# EAGLE design TapClip.v2 (EAGLE 6.2)
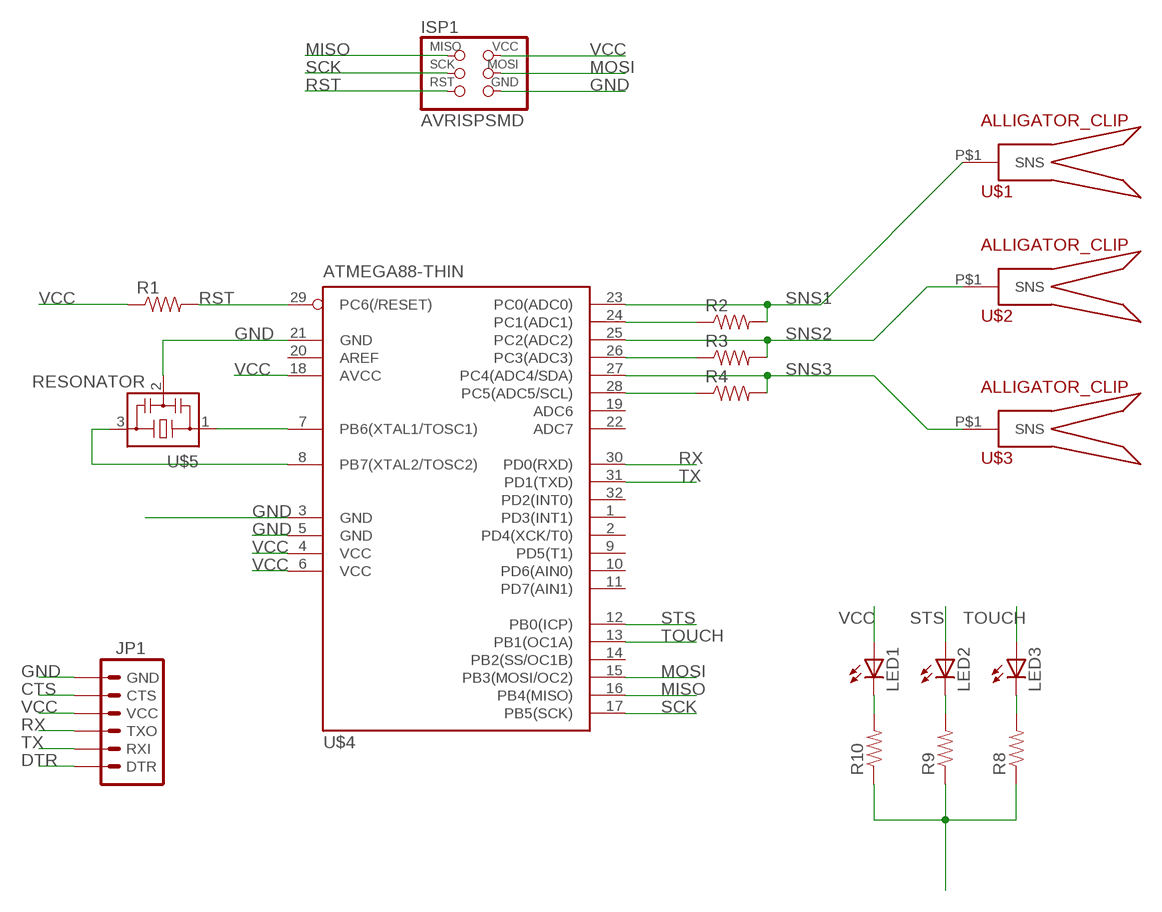
[diagram p0: schematic, sheet 1]

## Parts
ISP1  AVRISPSMD  [2X03SMD]
JP1  ARDUINO_SERIAL_PROGRAMSMD  [1X06-SMD]
LED1  LED1206  [LED-1206]
LED2  LED1206  [LED-1206]
LED3  LED1206  [LED-1206]
R1  RESISTOR0603-RES  [0603-RES]
R2  RESISTOR0603-RES  [0603-RES]
R3  RESISTOR0603-RES  [0603-RES]
R4  RESISTOR0603-RES  [0603-RES]
R8  RESISTOR1206  [1206]
R9  RESISTOR1206  [1206]
R10  RESISTOR1206  [1206]
U$1  ALLIGATOR_CLIP  [ALLIGATOR_CLIP]
U$2  ALLIGATOR_CLIP  [ALLIGATOR_CLIP]
U$3  ALLIGATOR_CLIP  [ALLIGATOR_CLIP]
U$4  ATMEGA88-THIN  [TQFP32-08THIN]
U$5  RESONATOR  [EFOBM]

## Nets
CTS: JP1.5(CTS)
DTR: JP1.1(DTR)
GND: ISP1.6(GND) JP1.6(GND) R8.1 R9.1 R10.1 U$4.3(GND) U$4.5(GND) U$4.21(GND) U$5.2
MISO: ISP1.1(MISO) U$4.16(PB4(MISO))
MOSI: ISP1.4(MOSI) U$4.15(PB3(MOSI/OC2))
N$2: R2.1 U$4.24(PC1(ADC1))
N$3: LED1.C R10.2
N$4: R3.1 U$4.26(PC3(ADC3))
N$5: LED2.C R9.2
N$6: R4.1 U$4.28(PC5(ADC5/SCL))
N$7: LED3.C R8.2
N$9: U$4.8(PB7(XTAL2/TOSC2)) U$5.3
N$10: U$4.7(PB6(XTAL1/TOSC1)) U$5.1
RST: ISP1.5(RST) R1.2 U$4.29(PC6(/RESET))
RX: JP1.3(TXO) U$4.30(PD0(RXD))
SCK: ISP1.3(SCK) U$4.17(PB5(SCK))
SNS1: R2.2 U$1.P$1(SNS) U$4.23(PC0(ADC0))
SNS2: R3.2 U$2.P$1(SNS) U$4.25(PC2(ADC2))
SNS3: R4.2 U$3.P$1(SNS) U$4.27(PC4(ADC4/SDA))
STS: LED2.A U$4.12(PB0(ICP))
TOUCH: LED3.A U$4.13(PB1(OC1A))
TX: JP1.2(RXI) U$4.31(PD1(TXD))
VCC: ISP1.2(VCC) JP1.4(VCC) LED1.A R1.1 U$4.4(VCC) U$4.6(VCC) U$4.18(AVCC)
Unconnected: U$4.1(PD3(INT1)) U$4.2(PD4(XCK/T0)) U$4.9(PD5(T1)) U$4.10(PD6(AIN0)) U$4.11(PD7(AIN1)) U$4.14(PB2(SS/OC1B)) U$4.19(ADC6) U$4.20(AREF) U$4.22(ADC7) U$4.32(PD2(INT0))

## Library data of the parts
ISP1 = fab:AVRISP
JP1 = SparkFun:ARDUINO_SERIAL_PROGRAM
LED1-LED3 = SparkFun:LED: LEDs Standard schematic elements and footprints for 5mm, 3mm, 1206, and 0603 sized LEDs. 5mm - Spark Fun Electronics SKU : COM-00529 (and others)
R1-R4 R8-R10 = SparkFun:RESISTOR: Resistor Basic schematic elements and footprints for 0603, 1206, and PTH resistors.
U$1-U$3 = sdgj:ALLIGATOR_CLIP
U$4 = fab:ATMEGA88-THIN
U$5 = fab:RESONATOR

## Board
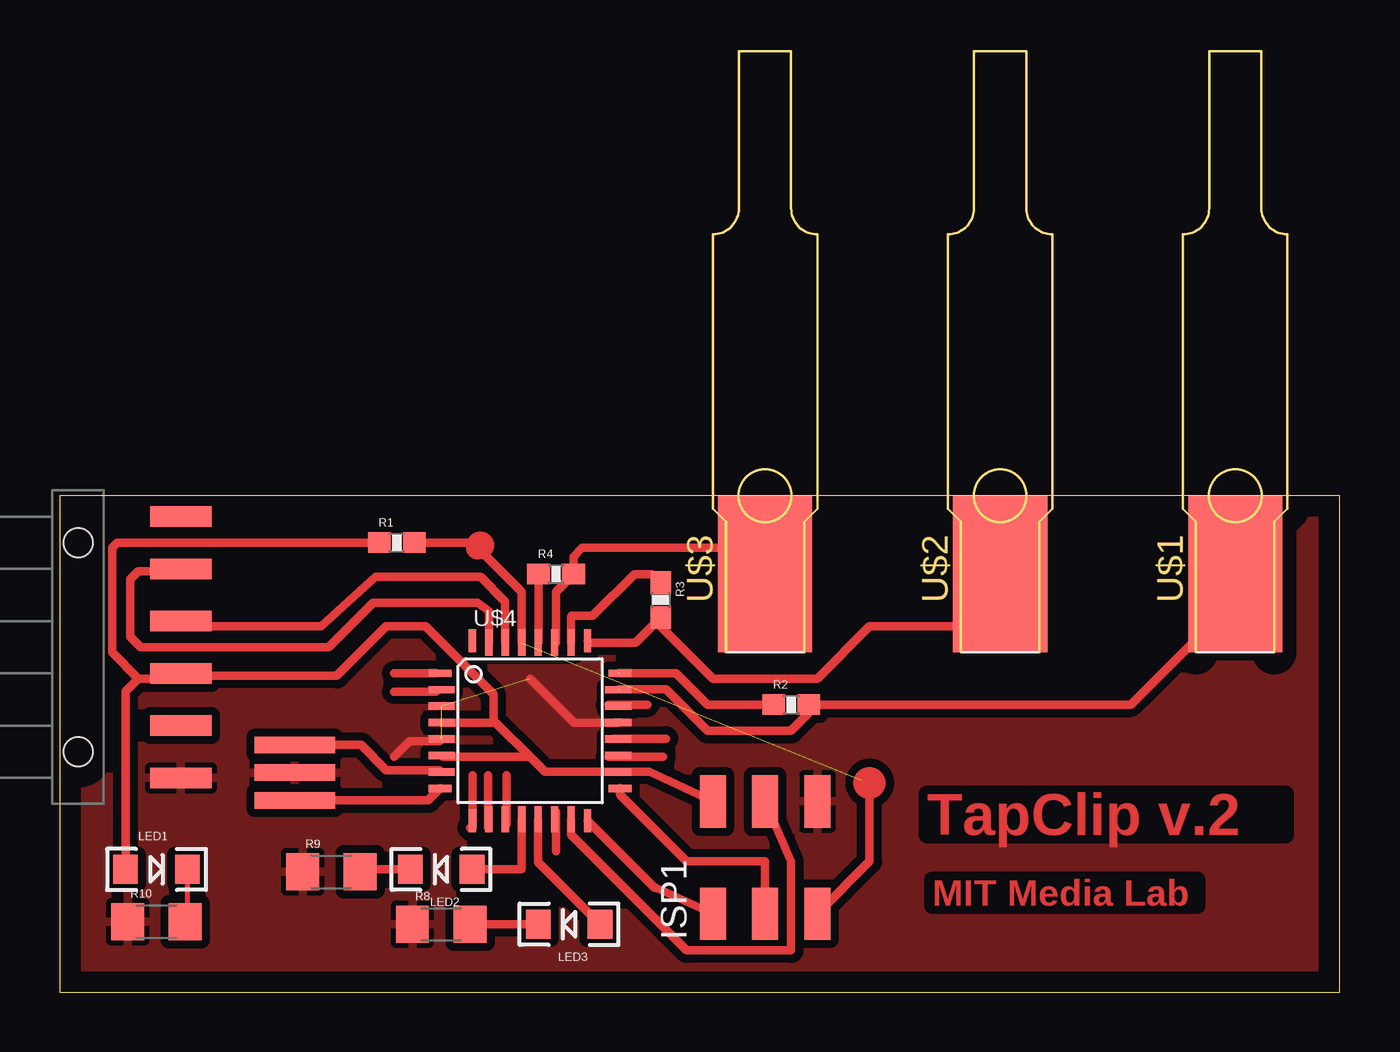
[diagram p1: board, top side]
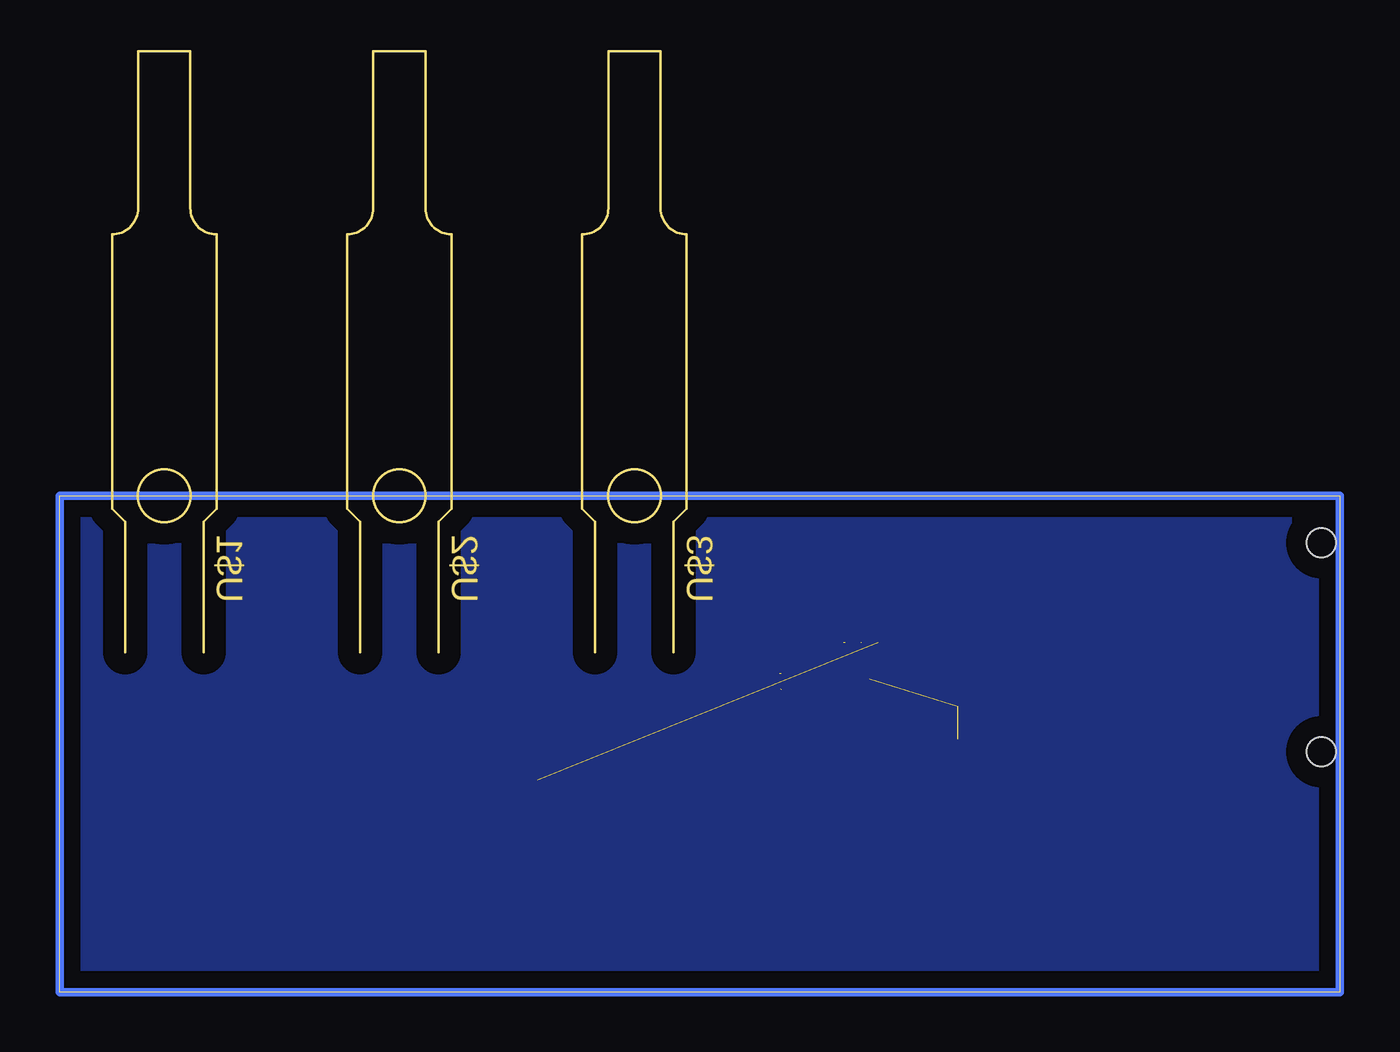
[diagram p2: board, bottom side, seen from below]

Size 62.23 x 24.13 mm. Coordinates in mm from the lower left corner, seen from the top.
Outline: 0,0 62.23,0 62.23,24.13 0,24.13 0,0
Copper layers (1*16): Top 0.035mm / dielectric 1.5mm / Bottom 0.035mm
Design rules: minimum track width 10mil, minimum drill 24mil, track to track 8mil, track to pad 8mil, pad to pad 8mil, via to via 8mil, smd to smd 8mil, copper to edge 40mil, drill to drill 8mil, minimum pad ring 10mil, minimum via ring 8mil, stop-mask expansion 4mil, vias tented up to drill 0mil, thermal gap 10mil

### Footprints (pad centres in the part's own frame; a part is rotated, then mirrored left to right if it is on the bottom)
2X03SMD = smd 2.54 x 1.27: 1 -2.54,2.54; 2 2.92,2.54; 3 -2.54,0; 4 2.92,0; 5 -2.54,-2.54; 6 2.92,-2.54
1X06-SMD = smd 1 x 3: 1 -6.35,5; 2 -3.81,5; 3 -1.27,5; 4 1.27,5; 5 3.81,5; 6 6.35,5 | hole 1.4: -5.08,0; 5.08,0
LED-1206 = smd 1.2 x 1.4: A -1.5,0; C 1.5,0
0603-RES = smd 1.1 x 1: 1 -0.85,0; 2 0.85,0
1206 = smd 1.6 x 1.8: 1 -1.4,0; 2 1.4,0
ALLIGATOR_CLIP = smd 7.62 x 4.572: P$1 0,0
TQFP32-08THIN = smd 1.118 x 0.356: 1 -4.369,2.8; 8 -4.369,-2.8; 17 4.369,-2.8; 24 4.369,2.8 | smd 1.27 x 0.356: 2 -4.293,2; 3 -4.293,1.2; 4 -4.293,0.4; 5 -4.293,-0.4; 6 -4.293,-1.2; 7 -4.293,-2; 18 4.293,-2; 19 4.293,-1.2; 20 4.293,-0.4; 21 4.293,0.4; 22 4.293,1.2; 23 4.293,2 | smd 0.356 x 1.118: 9 -2.8,-4.369; 16 2.8,-4.369; 25 2.8,4.369; 32 -2.8,4.369 | smd 0.356 x 1.27: 10 -2,-4.293; 14 1.2,-4.293; 15 2,-4.293; 26 2,4.293; 27 1.2,4.293; 31 -2,4.293 | smd 0.35 x 1.27: 11 -1.2,-4.293; 12 -0.4,-4.293; 13 0.4,-4.293; 28 0.4,4.293; 29 -0.4,4.293; 30 -1.2,4.293
EFOBM = smd 0.8 x 3.9: 1 -1.35,0; 2 0,0; 3 1.35,0

### Placement (x,y rotation side)
ISP1  34.29,6.35 90 top
JP1  0.89,16.76 270 top
LED1  4.7,5.97 0 top
LED2  18.54,5.97 180 top
LED3  24.77,3.3 180 top
R1  16.38,21.84 0 top
R2  35.56,13.97 0 top
R3  29.21,19.05 270 top
R4  24.13,20.32 0 top
R8  18.54,3.3 0 top
R9  13.21,5.84 0 top
R10  4.7,3.43 0 top
U$1  57.15,20.32 90 top
U$2  45.72,20.32 90 top
U$3  34.29,20.32 90 top
U$4  22.86,12.7 0 top
U$5  11.43,10.67 270 top

### Tracks (layer width: path | path; a pad name or v marks a point on that pad's centre or on a via)
GND  (2 unrouted)
  Top 0.406: 16.26,11.43 17.02,12.19 18.46,12.19 U$4.5 | U$4.21 25,13.1 22.86,15.24
  pour Top (isolate 0.406): 0,24.13 0,0 62.23,0 arc2 62.23,24.13
MISO
  Top 0.406: ISP1.1 28.99,5.08 28.91,5.08 U$4.16
MOSI
  Top 0.406: ISP1.4 35.56,6.35 35.56,2.03 30.48,2.03 24.86,7.65 U$4.15
N$1
  Bottom 0.406: 0,22.86 0,0 62.23,0 62.23,24.13 0,24.13 0,22.86
N$2  (1 unrouted)
  Top 0.406: 27.16,15.49 29.97,15.49 31.5,13.97 R2.1
N$3
  Top 0.254: LED1.C 6.2,3.53 R10.2
N$4
  Top 0.406: R3.1 28.79,20.32 27.94,20.32 25.91,18.29 24.89,18.29 24.86,18.26 U$4.26
N$5
  Top 0.406: LED2.C 14.73,5.97 R9.2
N$6  (1 unrouted)
  Top 0.406: 23.28,16.99 R4.1
N$7
  Top 0.406: LED3.C R8.2
N$8
  pour Bottom: 0,24.13 0,0 62.23,0 62.23,24.13
N$9
  Top 0.406: U$5.3 17.91,9.32 U$4.8
N$10
  Top 0.406: U$5.1 14.65,12.02 15.87,10.8 18.47,10.8 U$4.7
N$11
  Top 0.406: 18.29,15.49 16.26,15.49
N$12
  Top 0.406: 18.29,14.61 16.26,14.61
N$13
  Top 0.406: 26.92,12.32 29.46,12.32
N$14
  Top 0.406: 26.67,11.43 29.34,11.43
N$15
  Top 0.406: 26.67,13.97 28.58,13.97
N$16
  Top 0.406: 24.13,8.76 24.13,6.86
N$17
  Top 0.406: 19.94,8 20.07,8 20.07,10.54
N$18
  Top 0.406: 20.83,8 20.83,10.54
N$19
  Top 0.406: 21.72,8.13 21.72,10.54
RST  (1 unrouted)
  Top 0.254: 39.37,10.41 39.37,10.03 39.12,10.03 | 39.12,10.03 38.99,10.03 38.99,10.29 39.24,10.29 39.24,10.41 | 39.24,10.41 39.12,10.41 | 39.12,10.41 39.12,10.03 | 39.12,10.03 39.12,9.78 39.62,9.78 39.62,10.03 39.75,10.03 39.75,10.16 39.5,10.16 39.5,10.29 39.62,10.29 39.62,10.41 39.24,10.41 | 39.12,10.41 39.12,10.54 39.75,10.54 39.75,10.29
  Top 0.406: U$4.29 22.46,19.45 20.07,21.84 R1.2 | ISP1.5 39.37,6.35 39.37,10.03 39.37,10.16
RX
  Top 0.406: U$4.30 21.66,18.98 20.45,20.19 15.37,20.19 12.7,17.78 6.14,17.78 JP1.3
SCK
  Top 0.406: U$4.17 27.23,9.6 30.48,6.35 34.29,6.35 ISP1.3
SNS1  (1 unrouted)
  Top 0.406: 27.19,14.73 29.46,14.73 31.5,12.7 35.56,12.7 36.41,13.55 R2.2 52.07,13.97 57.15,19.05 U$1.P$1
SNS2
  Top 0.406: U$2.P$1 45.72,17.78 39.37,17.78 36.83,15.24 31.75,15.24 29.21,17.78 R3.2 28,16.99 25.74,16.99 U$4.25
SNS3  (1 unrouted)
  Top 0.406: 24.13,16.99 24.13,19.47 R4.2 24.98,21.17 25.4,21.59 34.29,21.59 U$3.P$1
STS
  Top 0.406: LED2.A 22.46,5.96 U$4.12
TOUCH
  Top 0.406: U$4.13 23.26,6.31 LED3.A
TX
  Top 0.406: U$4.31 20.86,18.51 20.32,18.92 15.24,18.92 13.08,16.76 3.94,16.76 3.43,17.27 3.43,20.07 3.81,20.45 5.76,20.45 JP1.2
VCC
  Top 0.406: ISP1.2 28.67,10.7 U$4.18 23.59,10.7 22.86,11.43 | LED1.A 3.2,14.63 3.81,15.24 | 3.81,15.24 2.54,16.51 2.54,21.59 2.79,21.84 R1.1 | U$4.6 18.64,11.43 22.86,11.43 | 3.81,15.24 5.08,15.24 5.33,15.49 JP1.4 6.02,15.37 13.46,15.37 15.87,17.78 17.78,17.78 21.08,14.48 21.08,13.08 21.06,13.1 U$4.4 21.19,13.1 22.86,11.43
(copper drawn outside any net)
  shapes: Top circle x3

### Text on the board
Top: TapClip v.2 | MIT Media Lab